# EAGLE design targetController (EAGLE 6.5.0)
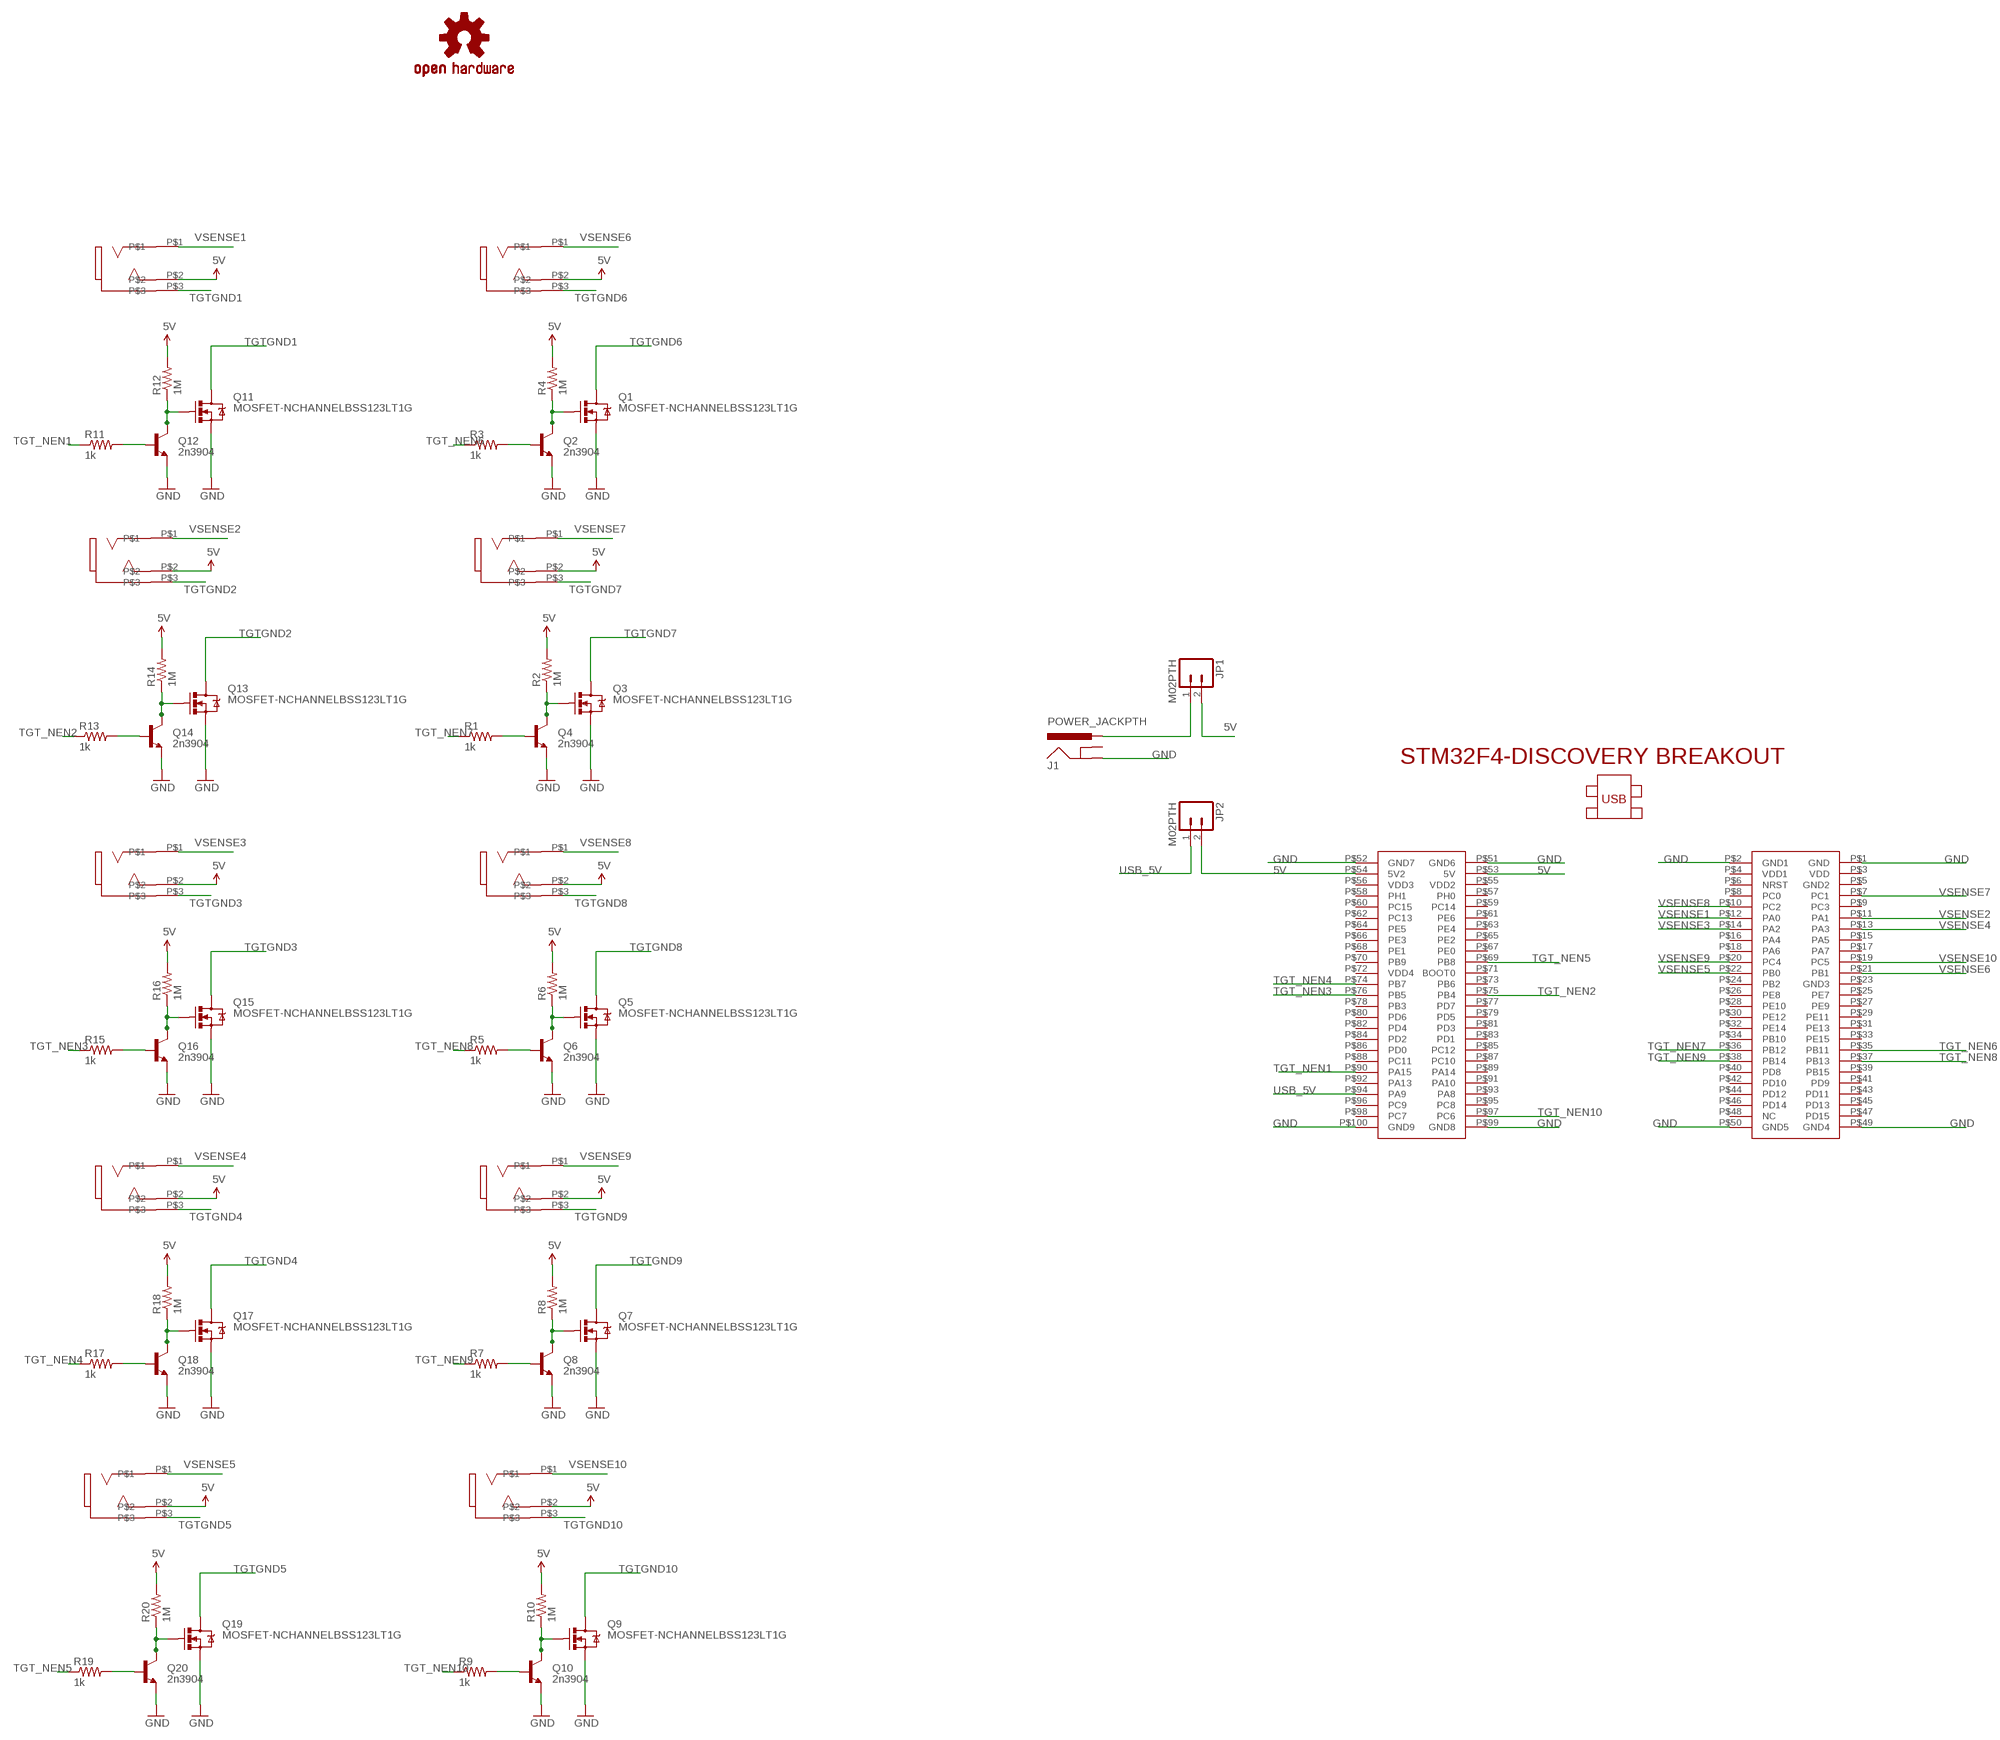
[diagram p0: schematic, sheet 1]

## Parts
J1  POWER_JACKPTH  [POWER_JACK_PTH]
JP1  M02PTH  [1X02]
JP2  M02PTH  [1X02]
LOGO1  OSHW-LOGOS  [OSHW-LOGO-S]
Q1  MOSFET-NCHANNELBSS123LT1G  [SOT23]
Q2  2n3904  TRANSISTOR_NPNSOT23-3  [SOT23-3]
Q3  MOSFET-NCHANNELBSS123LT1G  [SOT23]
Q4  2n3904  TRANSISTOR_NPNSOT23-3  [SOT23-3]
Q5  MOSFET-NCHANNELBSS123LT1G  [SOT23]
Q6  2n3904  TRANSISTOR_NPNSOT23-3  [SOT23-3]
Q7  MOSFET-NCHANNELBSS123LT1G  [SOT23]
Q8  2n3904  TRANSISTOR_NPNSOT23-3  [SOT23-3]
Q9  MOSFET-NCHANNELBSS123LT1G  [SOT23]
Q10  2n3904  TRANSISTOR_NPNSOT23-3  [SOT23-3]
Q11  MOSFET-NCHANNELBSS123LT1G  [SOT23]
Q12  2n3904  TRANSISTOR_NPNSOT23-3  [SOT23-3]
Q13  MOSFET-NCHANNELBSS123LT1G  [SOT23]
Q14  2n3904  TRANSISTOR_NPNSOT23-3  [SOT23-3]
Q15  MOSFET-NCHANNELBSS123LT1G  [SOT23]
Q16  2n3904  TRANSISTOR_NPNSOT23-3  [SOT23-3]
Q17  MOSFET-NCHANNELBSS123LT1G  [SOT23]
Q18  2n3904  TRANSISTOR_NPNSOT23-3  [SOT23-3]
Q19  MOSFET-NCHANNELBSS123LT1G  [SOT23]
Q20  2n3904  TRANSISTOR_NPNSOT23-3  [SOT23-3]
R1  1k  RESISTOR0805-RES  [0805]
R2  1M  RESISTOR0805-RES  [0805]
R3  1k  RESISTOR0805-RES  [0805]
R4  1M  RESISTOR0805-RES  [0805]
R5  1k  RESISTOR0805-RES  [0805]
R6  1M  RESISTOR0805-RES  [0805]
R7  1k  RESISTOR0805-RES  [0805]
R8  1M  RESISTOR0805-RES  [0805]
R9  1k  RESISTOR0805-RES  [0805]
R10  1M  RESISTOR0805-RES  [0805]
R11  1k  RESISTOR0805-RES  [0805]
R12  1M  RESISTOR0805-RES  [0805]
R13  1k  RESISTOR0805-RES  [0805]
R14  1M  RESISTOR0805-RES  [0805]
R15  1k  RESISTOR0805-RES  [0805]
R16  1M  RESISTOR0805-RES  [0805]
R17  1k  RESISTOR0805-RES  [0805]
R18  1M  RESISTOR0805-RES  [0805]
R19  1k  RESISTOR0805-RES  [0805]
R20  1M  RESISTOR0805-RES  [0805]
T1  35RASMT2BHNTRX  [35RASMT2BHNTRX]
T2  35RASMT2BHNTRX  [35RASMT2BHNTRX]
T3  35RASMT2BHNTRX  [35RASMT2BHNTRX]
T4  35RASMT2BHNTRX  [35RASMT2BHNTRX]
T5  35RASMT2BHNTRX  [35RASMT2BHNTRX]
T6  35RASMT2BHNTRX  [35RASMT2BHNTRX]
T7  35RASMT2BHNTRX  [35RASMT2BHNTRX]
T8  35RASMT2BHNTRX  [35RASMT2BHNTRX]
T9  35RASMT2BHNTRX  [35RASMT2BHNTRX]
T10  35RASMT2BHNTRX  [35RASMT2BHNTRX]
U$1  STM32F4-DISCOVERY  [STM32F4-DISCOVERY]

## Nets
5V: JP1.2 JP2.2 R2.2 R4.2 R6.2 R8.2 R10.2 R12.2 R14.2 R16.2 R18.2 R20.2 T1.P$2 T2.P$2 T3.P$2 T4.P$2 T5.P$2 T6.P$2 T7.P$2 T8.P$2 T9.P$2 T10.P$2 U$1.P$53(5V) U$1.P$54(5V2)
GND: J1.GND Q1.2(S) Q2.2(E) Q3.2(S) Q4.2(E) Q5.2(S) Q6.2(E) Q7.2(S) Q8.2(E) Q9.2(S) Q10.2(E) Q11.2(S) Q12.2(E) Q13.2(S) Q14.2(E) Q15.2(S) Q16.2(E) Q17.2(S) Q18.2(E) Q19.2(S) Q20.2(E) U$1.P$1(GND) U$1.P$2(GND1) U$1.P$49(GND4) U$1.P$50(GND5) U$1.P$51(GND6) U$1.P$52(GND7) U$1.P$99(GND8) U$1.P$100(GND9)
N1: Q3.1(G) Q4.3(C) R2.1
N2: Q5.1(G) Q6.3(C) R6.1
N3: Q1.1(G) Q2.3(C) R4.1
N4: Q7.1(G) Q8.3(C) R8.1
N5: Q9.1(G) Q10.3(C) R10.1
N6: Q11.1(G) Q12.3(C) R12.1
N7: Q13.1(G) Q14.3(C) R14.1
N8: Q15.1(G) Q16.3(C) R16.1
N9: Q17.1(G) Q18.3(C) R18.1
N10: Q19.1(G) Q20.3(C) R20.1
N$1: Q4.1(B) R1.2
N$2: J1.PWR JP1.1
N$4: Q2.1(B) R3.2
N$5: Q6.1(B) R5.2
N$7: Q8.1(B) R7.2
N$9: Q10.1(B) R9.2
N$11: Q12.1(B) R11.2
N$13: Q14.1(B) R13.2
N$15: Q16.1(B) R15.2
N$17: Q18.1(B) R17.2
N$19: Q20.1(B) R19.2
TGT_NEN1: R11.1 U$1.P$90(PA15)
TGT_NEN2: R13.1 U$1.P$75(PB4)
TGT_NEN3: R15.1 U$1.P$76(PB5)
TGT_NEN4: R17.1 U$1.P$74(PB7)
TGT_NEN5: R19.1 U$1.P$69(PB8)
TGT_NEN6: R3.1 U$1.P$35(PB11)
TGT_NEN7: R1.1 U$1.P$36(PB12)
TGT_NEN8: R5.1 U$1.P$37(PB13)
TGT_NEN9: R7.1 U$1.P$38(PB14)
TGT_NEN10: R9.1 U$1.P$97(PC6)
TGTGND1: Q11.3(D) T1.P$3
TGTGND2: Q13.3(D) T2.P$3
TGTGND3: Q15.3(D) T3.P$3
TGTGND4: Q17.3(D) T4.P$3
TGTGND5: Q19.3(D) T5.P$3
TGTGND6: Q1.3(D) T6.P$3
TGTGND7: Q3.3(D) T7.P$3
TGTGND8: Q5.3(D) T8.P$3
TGTGND9: Q7.3(D) T9.P$3
TGTGND10: Q9.3(D) T10.P$3
USB_5V: JP2.1 U$1.P$94(PA9)
VSENSE1: T1.P$1 U$1.P$12(PA0)
VSENSE2: T2.P$1 U$1.P$11(PA1)
VSENSE3: T3.P$1 U$1.P$14(PA2)
VSENSE4: T4.P$1 U$1.P$13(PA3)
VSENSE5: T5.P$1 U$1.P$22(PB0)
VSENSE6: T6.P$1 U$1.P$21(PB1)
VSENSE7: T7.P$1 U$1.P$7(PC1)
VSENSE8: T8.P$1 U$1.P$10(PC2)
VSENSE9: T9.P$1 U$1.P$20(PC4)
VSENSE10: T10.P$1 U$1.P$19(PC5)
Unconnected: J1.GNDBREAK U$1.P$3(VDD) U$1.P$4(VDD1) U$1.P$5(GND2) U$1.P$6(NRST) U$1.P$8(PC0) U$1.P$9(PC3) U$1.P$15(PA5) U$1.P$16(PA4) U$1.P$17(PA7) U$1.P$18(PA6) U$1.P$23(GND3) U$1.P$24(PB2) U$1.P$25(PE7) U$1.P$26(PE8) U$1.P$27(PE9) U$1.P$28(PE10) U$1.P$29(PE11) U$1.P$30(PE12) U$1.P$31(PE13) U$1.P$32(PE14) U$1.P$33(PE15) U$1.P$34(PB10) U$1.P$39(PB15) U$1.P$40(PD8) U$1.P$41(PD9) U$1.P$42(PD10) U$1.P$43(PD11) U$1.P$44(PD12) U$1.P$45(PD13) U$1.P$46(PD14) U$1.P$47(PD15) U$1.P$48(NC) U$1.P$55(VDD2) U$1.P$56(VDD3) U$1.P$57(PH0) U$1.P$58(PH1) U$1.P$59(PC14) U$1.P$60(PC15) U$1.P$61(PE6) U$1.P$62(PC13) U$1.P$63(PE4) U$1.P$64(PE5) U$1.P$65(PE2) U$1.P$66(PE3) U$1.P$67(PE0) U$1.P$68(PE1) U$1.P$70(PB9) U$1.P$71(BOOT0) U$1.P$72(VDD4) U$1.P$73(PB6) U$1.P$77(PD7) U$1.P$78(PB3) U$1.P$79(PD5) U$1.P$80(PD6) U$1.P$81(PD3) U$1.P$82(PD4) U$1.P$83(PD1) U$1.P$84(PD2) U$1.P$85(PC12) U$1.P$86(PD0) U$1.P$87(PC10) U$1.P$88(PC11) U$1.P$89(PA14) U$1.P$91(PA10) U$1.P$92(PA13) U$1.P$93(PA8) U$1.P$95(PC8) U$1.P$96(PC9) U$1.P$98(PC7)

## Library data of the parts
J1 = SparkFun-Connectors:POWER_JACK: Power Jack This is the standard 5.5mm barrel jack for power. The PTH is the most common, proven, reliable, footprint. The Slot footprint only works if the mill layer is transmitted to the PCB fab house so be warned. Mating wall wart : TOL-00298 (and others); PROD_ID: PRT-00119
JP1 JP2 = SparkFun-Connectors:M02: Standard 2-pin 0.1" header. Use with - straight break away headers ( PRT-00116) - right angle break away headers (PRT-00553) - swiss pins (PRT-00743) - machine pins (PRT-00117) - female headers (PRT-00115) Molex polarized connector foot print use with: PRT-08233 with associated crimp pins and housings. 2.54_SCREWTERM for use with PRT-10571. 3.5mm Screw Terminal footprints for PRT-08084 5mm Screw Terminal footprints for use with PRT-08433
LOGO1 = SparkFun-Aesthetics:OSHW-LOGO: Open Source Hardware Logo This logo indicates the piece of hardware it is found on incorporates a OSHW license and/or adheres to the definition of open source hardware found here: http://freedomdefined.org/OSHW
Q1 Q3 Q5 Q7 Q9 Q11 Q13 Q15 Q17 Q19 = SparkFun-DiscreteSemi:MOSFET-NCHANNEL: Common NMOSFET Parts MFG P/N Store ID Prod ID FDD8780 TRANS-09984 SI7820DN TRANS-11055 FDS6630A IC-08089 2N7002PW TRANS-11151 FQP30N06L COM-10213 TRANS-10060 BSS123LT1G TRANS-08345 BSS138 TRANS-00830 BS170 2N7000; PROD_ID: TRANS-08345
Q2 Q4 Q6 Q8 Q10 Q12 Q14 Q16 Q18 Q20 = SparkFun-DiscreteSemi:TRANSISTOR_NPN: Generic NPN BJT MMBT2222A - TRANS-08049 (SOT-23, 1A 40V) MPSA42 - TRANS-09116 (SOT-23, 500mA 300V) MMBT5088LT1G - TRANS-11160 (SOT-23, 50 mA 30V)
R1-R20 = SparkFun-Resistors:RESISTOR: Resistor Basic schematic elements and footprints for 0603, 1206, and PTH resistors.
T1-T10 = alvarop-lib:35RASMT2BHNTRX
U$1 = STM32F4-DISCOVERY:STM32F4-DISCOVERY

## Board
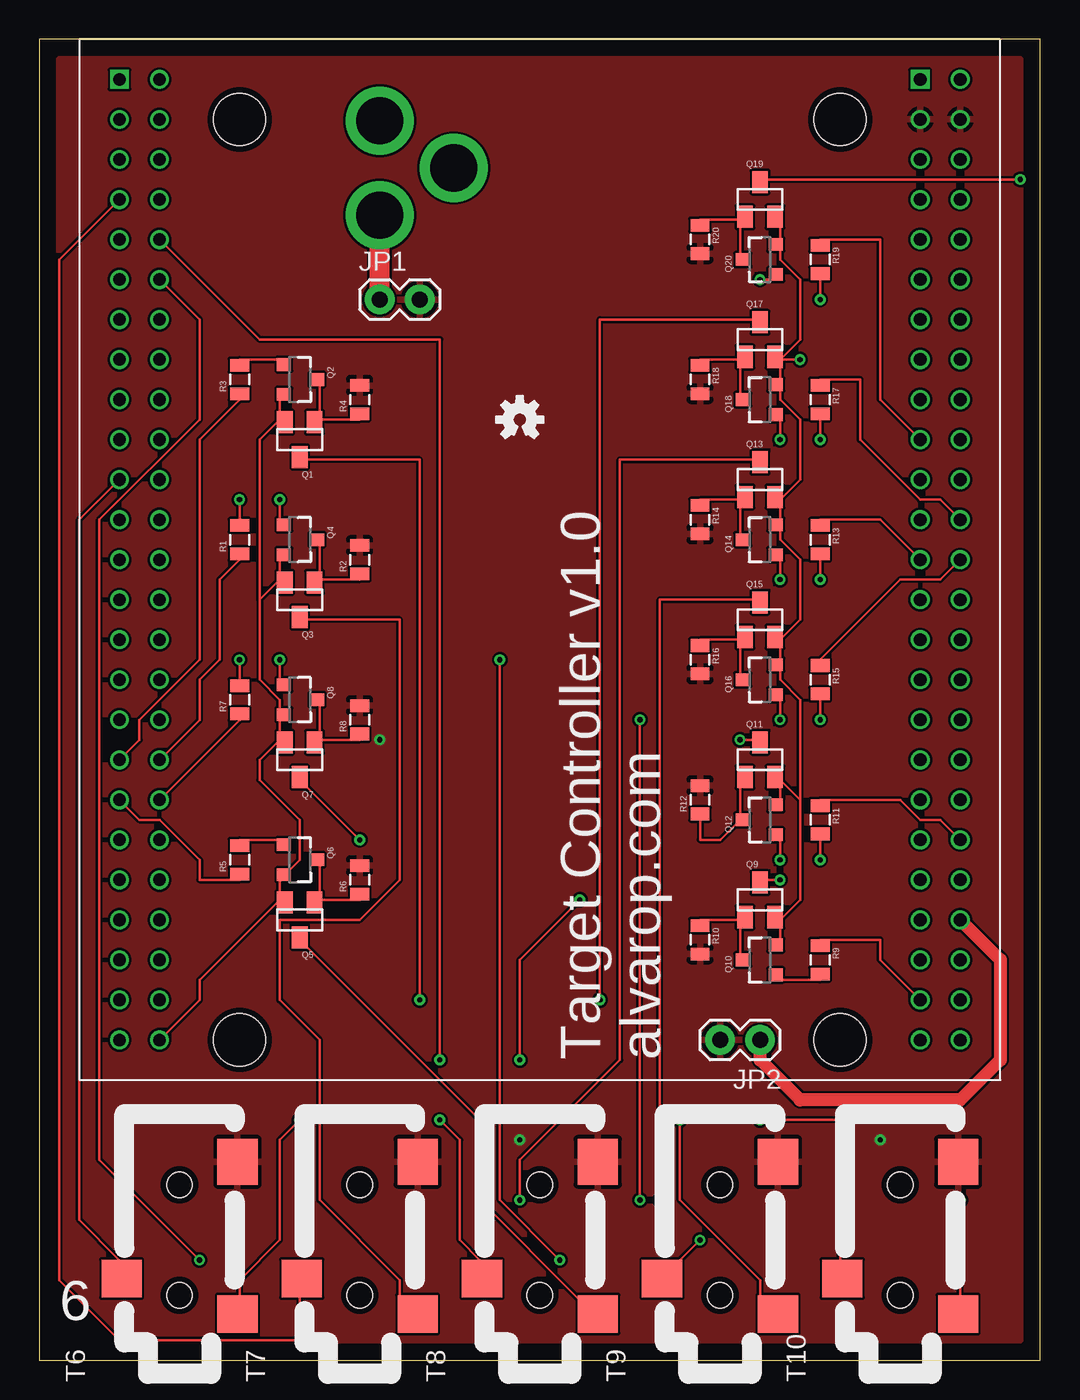
[diagram p1: board, top side]
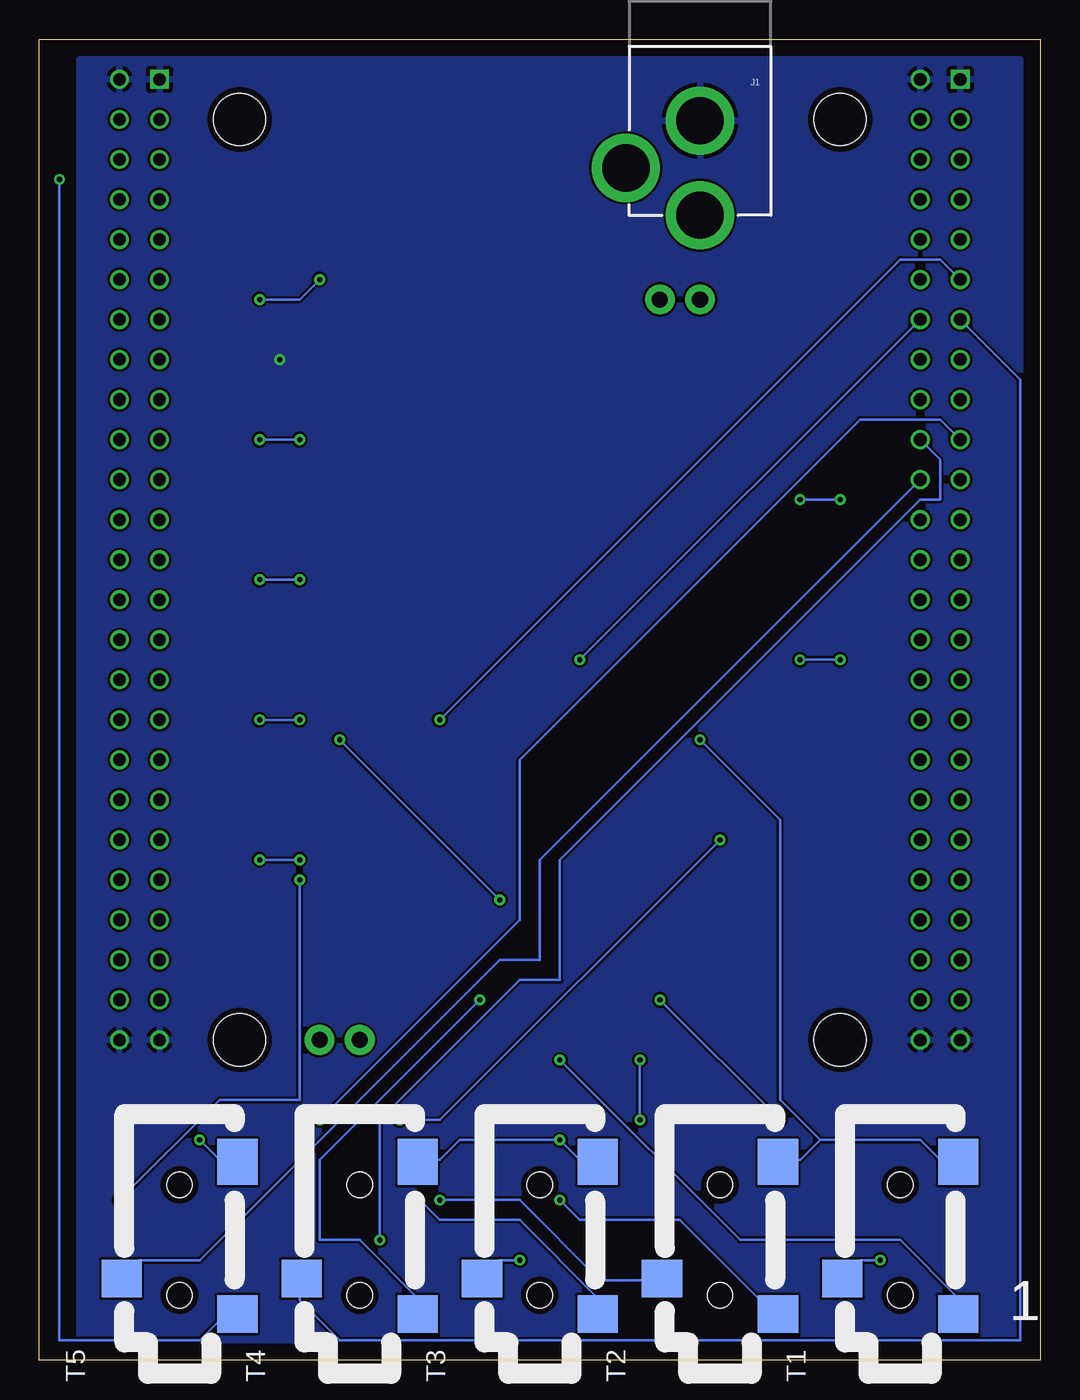
[diagram p2: board, bottom side, seen from below]

Size 63.5 x 83.82 mm. Coordinates in mm from the lower left corner, seen from the top.
Outline: 0,0 63.5,0 63.5,83.82 0,83.82 0,0
Copper layers (1*16): Top 0.0356mm / dielectric 1.5011mm / Bottom 0.0356mm
Design rules "LaenPCBOrder": minimum track width 6mil, minimum drill 13mil, track to track 6mil, track to pad 6mil, pad to pad 6mil, via to via 6mil, smd to smd 6mil, copper to edge 15mil, drill to drill 6mil, minimum pad ring 7mil, minimum via ring 7mil, stop-mask expansion 3mil, vias tented up to drill 0mil, thermal gap 10mil

### Footprints (pad centres in the part's own frame; a part is rotated, then mirrored left to right if it is on the bottom)
POWER_JACK_PTH = drill 2.997 pad 4.318: GND 0,7.7; GNDBREAK 4.7,10.7; PWR 0,13.7
1X02 = drill 1.016 pad 1.88: 1 0,0; 2 2.54,0
SOT23 = smd 1 x 1.4: 1 -0.95,-1.1; 2 0.95,-1.1; 3 0,1.1
SOT23-3 = smd 0.8 x 0.9: 1 -0.95,-1; 2 0.95,-1; 3 0,1.1
0805 = smd 0.8 x 1.2: 1 -0.9,0; 2 0.9,0
35RASMT2BHNTRX = smd 2.4 x 2.55: P$1 -2.44,3.675; P$3 -4.7,-3.675 | smd 2.9 x 2.55: P$2 4.96,-3.675 | hole 1.6: -3.5,0; 3.5,0
STM32F4-DISCOVERY = drill 0.8 square: P$1 -27.94,30.48; P$51 22.86,30.48 | drill 0.8: P$2 -25.4,30.48; P$3 -27.94,27.94; P$4 -25.4,27.94; P$5 -27.94,25.4; P$6 -25.4,25.4; P$7 -27.94,22.86; P$8 -25.4,22.86; P$9 -27.94,20.32; P$10 -25.4,20.32; P$11 -27.94,17.78; P$12 -25.4,17.78; P$13 -27.94,15.24; P$14 -25.4,15.24; P$15 -27.94,12.7; P$16 -25.4,12.7; P$17 -27.94,10.16; P$18 -25.4,10.16; P$19 -27.94,7.62; P$20 -25.4,7.62; P$21 -27.94,5.08; P$22 -25.4,5.08; P$23 -27.94,2.54; P$24 -25.4,2.54; P$25 -27.94,0; P$26 -25.4,0; P$27 -27.94,-2.54; P$28 -25.4,-2.54; P$29 -27.94,-5.08; P$30 -25.4,-5.08; P$31 -27.94,-7.62; P$32 -25.4,-7.62; P$33 -27.94,-10.16; P$34 -25.4,-10.16; P$35 -27.94,-12.7; P$36 -25.4,-12.7; P$37 -27.94,-15.24; P$38 -25.4,-15.24; P$39 -27.94,-17.78; P$40 -25.4,-17.78; P$41 -27.94,-20.32; P$42 -25.4,-20.32; P$43 -27.94,-22.86; P$44 -25.4,-22.86; P$45 -27.94,-25.4; P$46 -25.4,-25.4; P$47 -27.94,-27.94; P$48 -25.4,-27.94; P$49 -27.94,-30.48; P$50 -25.4,-30.48; P$52 25.4,30.48; P$53 22.86,27.94; P$54 25.4,27.94; P$55 22.86,25.4; P$56 25.4,25.4; P$57 22.86,22.86; P$58 25.4,22.86; P$59 22.86,20.32; P$60 25.4,20.32; P$61 22.86,17.78; P$62 25.4,17.78; P$63 22.86,15.24; P$64 25.4,15.24; P$65 22.86,12.7; P$66 25.4,12.7; P$67 22.86,10.16; P$68 25.4,10.16; P$69 22.86,7.62; P$70 25.4,7.62; P$71 22.86,5.08; P$72 25.4,5.08; P$73 22.86,2.54; P$74 25.4,2.54; P$75 22.86,0; P$76 25.4,0; P$77 22.86,-2.54; P$78 25.4,-2.54; P$79 22.86,-5.08; P$80 25.4,-5.08; P$81 22.86,-7.62; P$82 25.4,-7.62; P$83 22.86,-10.16; P$84 25.4,-10.16; P$85 22.86,-12.7; P$86 25.4,-12.7; P$87 22.86,-15.24; P$88 25.4,-15.24; P$89 22.86,-17.78; P$90 25.4,-17.78; P$91 22.86,-20.32; P$92 25.4,-20.32; P$93 22.86,-22.86; P$94 25.4,-22.86; P$95 22.86,-25.4; P$96 25.4,-25.4; P$97 22.86,-27.94; P$98 25.4,-27.94; P$99 22.86,-30.48; P$100 25.4,-30.48
STAND-OFF = hole 3.302: 0,0

### Placement (x,y rotation side)
J1  21.59,86.36 180 bottom
JP1  21.59,67.31 0 top
JP2  45.72,20.32 180 top
LOGO1  30.48,59.69 0 top
Q1  16.51,58.42 180 top
Q2  16.51,62.23 270 top
Q3  16.51,48.26 180 top
Q4  16.51,52.07 270 top
Q5  16.51,27.94 180 top
Q6  16.51,31.75 270 top
Q7  16.51,38.1 180 top
Q8  16.51,41.91 270 top
Q9  45.72,29.21 0 top
Q10  45.72,25.4 90 top
Q11  45.72,38.1 0 top
Q12  45.72,34.29 90 top
Q13  45.72,55.88 0 top
Q14  45.72,52.07 90 top
Q15  45.72,46.99 0 top
Q16  45.72,43.18 90 top
Q17  45.72,64.77 0 top
Q18  45.72,60.96 90 top
Q19  45.72,73.66 0 top
Q20  45.72,69.85 90 top
R1  12.7,52.07 90 top
R2  20.32,50.8 90 top
R3  12.7,62.23 90 top
R4  20.32,60.96 90 top
R5  12.7,31.75 90 top
R6  20.32,30.48 90 top
R7  12.7,41.91 90 top
R8  20.32,40.64 90 top
R9  49.53,25.4 270 top
R10  41.91,26.67 270 top
R11  49.53,34.29 270 top
R12  41.91,35.56 90 top
R13  49.53,52.07 270 top
R14  41.91,53.34 270 top
R15  49.53,43.18 270 top
R16  41.91,44.45 270 top
R17  49.53,60.96 270 top
R18  41.91,62.23 270 top
R19  49.53,69.85 270 top
R20  41.91,71.12 270 top
T1  8.89,7.62 90 bottom
T2  20.32,7.62 90 bottom
T3  31.75,7.62 90 bottom
T4  43.18,7.62 90 bottom
T5  54.61,7.62 90 bottom
T6  8.89,7.62 90 top
T7  20.32,7.62 90 top
T8  31.75,7.62 90 top
T9  43.18,7.62 90 top
T10  54.61,7.62 90 top
U$1  33.02,50.8 0 top
U$2  [STAND-OFF]  12.7,78.74 0 top
U$3  [STAND-OFF]  50.8,78.74 0 top
U$4  [STAND-OFF]  12.7,20.32 0 top
U$5  [STAND-OFF]  50.8,20.32 0 top

### Tracks (layer width: path | path; a pad name or v marks a point on that pad's centre or on a via)
5V  (via drill 0.33)
  Bottom 0.152: T3.P$2 29.21,12.7 v30.48,13.97 36.83,13.97 38.1,12.7 39.37,12.7 T4.P$2 | v53.34,13.97 52.07,12.7 T5.P$2 | 13.97,13.97 7.62,13.97 6.35,12.7 T1.P$2 | 13.97,13.97 15.24,12.7 16.51,12.7 T2.P$2 | v21.59,39.37 16.51,34.29 16.51,16.51 13.97,13.97
  pour Top: 1.27,82.55 62.23,82.55 62.23,1.27 1.27,1.27
GND  (via drill 0.33)
  Top 0.152: 46.99,71.12 46.99,72.39 Q19.2 | 46.99,63.5 46.99,62.23 | 46.99,54.61 46.99,53.34 | 46.99,45.72 46.99,44.45 | 46.99,27.94 46.99,26.67 Q10.2 | 46.99,36.83 46.99,35.56 Q12.2 | 46.99,27.94 48.26,29.21 48.26,35.56 | 46.99,36.83 48.26,35.56 | 46.99,27.94 Q9.2 | 46.99,36.83 Q11.2 | 46.99,44.45 46.99,43.18 48.26,41.91 48.26,35.56 | 46.99,44.45 Q16.2 | 46.99,53.34 46.99,52.07 48.26,50.8 48.26,46.99 46.99,45.72 | 46.99,53.34 Q14.2 | 46.99,45.72 Q15.2 | 46.99,62.23 46.99,60.96 48.26,59.69 48.26,55.88 46.99,54.61 | 46.99,62.23 Q18.2 | 46.99,54.61 Q13.2 | 46.99,71.12 46.99,69.85 48.26,68.58 48.26,64.77 46.99,63.5 | 46.99,71.12 Q20.2 | 15.24,29.21 15.24,30.48 | 15.24,29.21 10.16,24.13 10.16,22.86 U$1.P$50 | 15.24,29.21 Q5.2 | 15.24,59.69 15.24,60.96 Q2.2 | 15.24,39.37 15.24,40.64 | 15.24,49.53 15.24,50.8 Q4.2 | 15.24,40.64 15.24,41.91 13.97,43.18 13.97,48.26 | 15.24,49.53 13.97,48.26 | 15.24,40.64 Q8.2 | 15.24,49.53 Q3.2 | 15.24,59.69 13.97,58.42 13.97,48.26 | 15.24,59.69 Q1.2 | 15.24,30.48 16.51,31.75 16.51,34.29 13.97,36.83 13.97,38.1 15.24,39.37 | 15.24,30.48 Q6.2 | 15.24,39.37 Q7.2 | v48.26,63.5 46.99,63.5 | 46.99,63.5 Q17.2
  pour Bottom: 1.27,82.55 1.27,1.27 60.96,1.27 60.96,82.55
N1
  Top 0.152: 17.78,49.53 17.78,52.07 Q4.3 | 17.78,49.53 20.32,49.53 R2.1 | 17.78,49.53 Q3.1
N2
  Top 0.152: 17.78,29.21 17.78,31.75 Q6.3 | 17.78,29.21 20.32,29.21 R6.1 | 17.78,29.21 Q5.1
N3
  Top 0.152: 17.78,59.69 17.78,62.23 Q2.3 | 17.78,59.69 20.32,59.69 R4.1 | 17.78,59.69 Q1.1
N4
  Top 0.152: 17.78,39.37 17.78,41.91 Q8.3 | 17.78,39.37 20.32,39.37 R8.1 | 17.78,39.37 Q7.1
N5
  Top 0.152: 44.45,27.94 44.45,25.4 Q10.3 | 44.45,27.94 41.91,27.94 R10.1 | 44.45,27.94 Q9.1
N6
  Top 0.152: 44.45,34.29 43.18,33.02 41.91,33.02 R12.1 | 44.45,34.29 44.45,36.83 Q11.1 | 44.45,34.29 Q12.3
N7
  Top 0.152: 44.45,54.61 44.45,52.07 Q14.3 | 44.45,54.61 41.91,54.61 R14.1 | 44.45,54.61 Q13.1
N8
  Top 0.152: 44.45,45.72 44.45,43.18 Q16.3 | 44.45,45.72 41.91,45.72 R16.1 | 44.45,45.72 Q15.1
N9
  Top 0.152: 44.45,63.5 44.45,60.96 Q18.3 | 44.45,63.5 41.91,63.5 R18.1 | 44.45,63.5 Q17.1
N10
  Top 0.152: 44.45,72.39 44.45,69.85 Q20.3 | 44.45,72.39 41.91,72.39 R20.1 | 44.45,72.39 Q19.1
N$1  (via drill 0.33)
  Top 0.152: v15.24,54.61 15.24,53.34 Q4.1 | R1.2 v12.7,54.61
  Bottom 0.152: v12.7,54.61 v15.24,54.61
N$2
  Top 0.152: 21.59,72.39 J1.PWR
  Top 1.27: JP1.1 21.59,72.39
N$4
  Top 0.152: Q2.1 15.24,63.5 12.7,63.5 R3.2
N$5
  Top 0.152: Q6.1 15.24,33.02 12.7,33.02 R5.2
N$7  (via drill 0.33)
  Top 0.152: v15.24,44.45 15.24,43.18 Q8.1 | R7.2 v12.7,44.45
  Bottom 0.152: v12.7,44.45 v15.24,44.45
N$9
  Top 0.152: Q10.1 46.99,24.13 49.53,24.13 R9.2
N$11  (via drill 0.33)
  Top 0.152: v46.99,31.75 46.99,33.02 Q12.1 | R11.2 v49.53,31.75
  Bottom 0.152: v49.53,31.75 v46.99,31.75
N$13  (via drill 0.33)
  Top 0.152: v46.99,49.53 46.99,50.8 Q14.1 | R13.2 v49.53,49.53
  Bottom 0.152: v49.53,49.53 v46.99,49.53
N$15  (via drill 0.33)
  Top 0.152: v46.99,40.64 46.99,41.91 Q16.1 | R15.2 v49.53,40.64
  Bottom 0.152: v49.53,40.64 v46.99,40.64
N$17  (via drill 0.33)
  Top 0.152: v46.99,58.42 46.99,59.69 Q18.1 | R17.2 v49.53,58.42
  Bottom 0.152: v49.53,58.42 v46.99,58.42
N$19  (via drill 0.33)
  Top 0.152: v45.72,68.58 46.99,68.58 Q20.1 | R19.2 v49.53,67.31
  Bottom 0.152: v45.72,68.58 46.99,67.31 v49.53,67.31
TGT_NEN1
  Top 0.152: U$1.P$90 57.15,34.29 55.88,34.29 54.61,35.56 49.53,35.56 R11.1
TGT_NEN2
  Top 0.152: U$1.P$75 53.34,53.34 49.53,53.34 R13.1
TGT_NEN3
  Top 0.152: U$1.P$76 57.15,49.53 54.61,49.53 49.53,44.45 R15.1
TGT_NEN4
  Top 0.152: U$1.P$74 57.15,54.61 55.88,54.61 52.07,58.42 52.07,62.23 49.53,62.23 R17.1
TGT_NEN5
  Top 0.152: U$1.P$69 53.34,60.96 53.34,71.12 49.53,71.12 R19.1
TGT_NEN6
  Top 0.152: U$1.P$35 6.35,39.37 6.35,40.64 10.16,44.45 10.16,58.42 12.7,60.96 R3.1
TGT_NEN7
  Top 0.152: U$1.P$36 10.16,40.64 10.16,43.18 11.43,44.45 11.43,49.53 12.7,50.8 R1.1
TGT_NEN8
  Top 0.152: U$1.P$37 6.35,34.29 7.62,34.29 10.16,31.75 10.16,30.48 12.7,30.48 R5.1
TGT_NEN9
  Top 0.152: U$1.P$38 12.7,40.64 R7.1
TGT_NEN10
  Top 0.152: U$1.P$97 53.34,25.4 53.34,26.67 49.53,26.67 R9.1
TGTGND1  (via drill 0.33)
  Top 0.152: v44.45,39.37 45.72,39.37 Q11.3 | v34.29,29.21 30.48,25.4 v30.48,19.05
  Bottom 0.152: v34.29,29.21 v44.45,39.37 | v30.48,19.05 19.05,7.62 8.89,7.62 5.08,3.81 T1.P$3
TGTGND2  (via drill 0.33)
  Top 0.152: v30.48,10.16 30.48,12.7 36.83,19.05 36.83,57.15 45.72,57.15 Q13.3
  Bottom 0.152: v30.48,10.16 29.21,8.89 22.86,8.89 17.78,3.81 T2.P$3
TGTGND3  (via drill 0.33)
  Top 0.152: v39.37,10.16 39.37,48.26 45.72,48.26 Q15.3
  Bottom 0.152: v39.37,10.16 38.1,8.89 33.02,8.89 27.94,3.81 T3.P$3
TGTGND4  (via drill 0.33)
  Top 0.152: v35.56,22.86 35.56,66.04 45.72,66.04 Q17.3
  Bottom 0.152: v35.56,22.86 45.72,12.7 45.72,7.62 43.18,7.62 39.37,3.81 T4.P$3
TGTGND5  (via drill 0.33)
  Top 0.152: v62.23,74.93 45.72,74.93 Q19.3
  Bottom 0.152: v62.23,74.93 62.23,1.27 53.34,1.27 52.07,2.54 T5.P$3
TGTGND6  (via drill 0.33)
  Top 0.152: v24.13,22.86 24.13,57.15 16.51,57.15 Q1.3 | v16.51,15.24 15.24,13.97 15.24,7.62 12.7,5.08 12.7,3.81 T6.P$3
  Bottom 0.152: v16.51,15.24 v24.13,22.86
TGTGND7
  Top 0.152: Q3.3 16.51,46.99 22.86,46.99 22.86,30.48 20.32,27.94 15.24,27.94 15.24,22.86 17.78,20.32 17.78,10.16 22.86,5.08 22.86,3.81 T7.P$3
TGTGND8
  Top 0.152: Q5.3 16.51,26.67 27.94,15.24 27.94,10.16 34.29,3.81 T8.P$3
TGTGND9  (via drill 0.33)
  Top 0.152: v20.32,33.02 16.51,36.83 Q7.3 | v40.64,15.24 40.64,10.16 45.72,5.08 45.72,3.81 T9.P$3
  Bottom 0.152: v20.32,33.02 38.1,15.24 v40.64,15.24
TGTGND10  (via drill 0.33)
  Top 0.152: v46.99,30.48 45.72,30.48 Q9.3 | v58.42,10.16 58.42,3.81 T10.P$3
  Bottom 0.152: v46.99,30.48 46.99,16.51 52.07,16.51 v58.42,10.16
USB_5V
  Top 0.813: U$1.P$94 60.96,25.4 60.96,19.05 58.42,16.51 48.26,16.51 45.72,19.05 JP2.1
VSENSE1  (via drill 0.33)
  Top 0.152: U$1.P$12 10.16,66.04 10.16,59.69 3.81,53.34 3.81,12.7 v10.16,6.35
  Bottom 0.152: v10.16,6.35 11.43,6.35 T1.P$1
VSENSE2  (via drill 0.33)
  Top 0.152: v38.1,10.16 v38.1,40.64
  Bottom 0.152: U$1.P$11 6.35,69.85 8.89,69.85 v38.1,40.64 | v38.1,10.16 33.02,10.16 27.94,5.08 24.13,5.08 T2.P$1
VSENSE3  (via drill 0.33)
  Top 0.152: v29.21,44.45 29.21,10.16 v33.02,6.35
  Bottom 0.152: v29.21,44.45 U$1.P$14 | v33.02,6.35 34.29,6.35 T3.P$1
VSENSE4
  Bottom 0.152: U$1.P$13 1.27,62.23 1.27,1.27 44.45,1.27 46.99,3.81 46.99,5.08 T4.P$1
VSENSE5
  Bottom 0.152: U$1.P$22 31.75,31.75 31.75,25.4 34.29,25.4 53.34,6.35 57.15,6.35 T5.P$1
VSENSE6
  Top 0.152: U$1.P$21 2.54,53.34 2.54,8.89 5.08,6.35 T6.P$1
VSENSE7
  Top 0.152: U$1.P$7 1.27,69.85 1.27,5.08 5.08,1.27 16.51,1.27 16.51,5.08 T7.P$1
VSENSE8  (via drill 0.33)
  Top 0.152: U$1.P$10 13.97,64.77 25.4,64.77 v25.4,19.05 | v25.4,15.24 26.67,13.97 26.67,7.62 27.94,6.35 T8.P$1
  Bottom 0.152: v25.4,15.24 v25.4,19.05
VSENSE9  (via drill 0.33)
  Top 0.152: v41.91,7.62 40.64,6.35 T9.P$1
  Bottom 0.152: U$1.P$20 6.35,57.15 6.35,54.61 7.62,54.61 30.48,31.75 30.48,24.13 33.02,24.13 41.91,15.24 v41.91,7.62
VSENSE10  (via drill 0.33)
  Top 0.152: v45.72,15.24 50.8,15.24 50.8,6.35 T10.P$1
  Bottom 0.152: U$1.P$19 6.35,59.69 11.43,59.69 33.02,38.1 33.02,27.94 v45.72,15.24

### Text on the board
tNames: Target Controller v1.0 | alvarop.com | 6
bNames: 1